# EAGLE design Driver and Matrix PCB v2 (EAGLE 9.6.2)
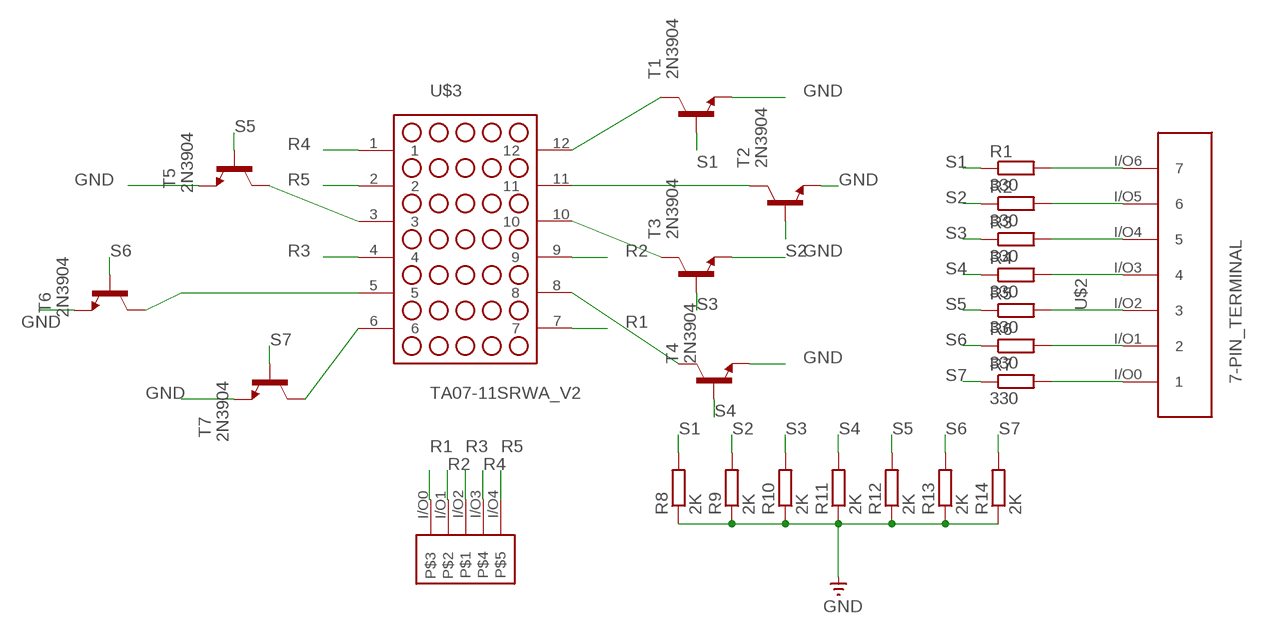
[diagram p0: schematic, sheet 1]

## Parts
GND1  GND  [GND]
R1  330  R-EU_0207/10  [0207/10]
R2  330  R-EU_0207/10  [0207/10]
R3  330  R-EU_0207/10  [0207/10]
R4  330  R-EU_0207/10  [0207/10]
R5  330  R-EU_0207/10  [0207/10]
R6  330  R-EU_0207/10  [0207/10]
R7  330  R-EU_0207/10  [0207/10]
R8  2K  R-EU_0207/12  [0207/12]
R9  2K  R-EU_0207/12  [0207/12]
R10  2K  R-EU_0207/12  [0207/12]
R11  2K  R-EU_0207/12  [0207/12]
R12  2K  R-EU_0207/12  [0207/12]
R13  2K  R-EU_0207/12  [0207/12]
R14  2K  R-EU_0207/12  [0207/12]
T1  2N3904  [TO92]
T2  2N3904  [TO92]
T3  2N3904  [TO92]
T4  2N3904  [TO92]
T5  2N3904  [TO92]
T6  2N3904  [TO92]
T7  2N3904  [TO92]
U$1  5-PIN_TERMINAL  [5-PIN_TERMINAL]
U$2  7-PIN_TERMINAL  [7-PIN_TERMINAL]
U$3  TA07-11SRWA_V2  [TA07-11SRWA_V2]

## Nets
GND: GND1.P$1(GND) R8.1 R9.1 R10.1 R11.1 R12.1 R13.1 R14.1 T1.3(E) T2.3(E) T3.3(E) T4.3(E) T5.3(E) T6.3(E) T7.3(E)
N$1: R1.2 U$2.I/O6
N$2: R2.2 U$2.I/O5
N$3: R3.2 U$2.I/O4
N$4: R4.2 U$2.I/O3
N$5: R5.2 U$2.I/O2
N$6: R6.2 U$2.I/O1
N$7: R7.2 U$2.I/O0
N$8: T7.1(C) U$3.6
N$9: T6.1(C) U$3.5
N$10: T5.1(C) U$3.3
N$11: T4.1(C) U$3.8
N$12: T3.1(C) U$3.10
N$13: T2.1(C) U$3.11
N$14: T1.1(C) U$3.12
R1: U$1.I/O0 U$3.7
R2: U$1.I/O1 U$3.9
R3: U$1.I/O2 U$3.4
R4: U$1.I/O3 U$3.1
R5: U$1.I/O4 U$3.2
S1: R1.1 R8.2 T1.2(B)
S2: R2.1 R9.2 T2.2(B)
S3: R3.1 R10.2 T3.2(B)
S4: R4.1 R11.2 T4.2(B)
S5: R5.1 R12.2 T5.2(B)
S6: R6.1 R13.2 T6.2(B)
S7: R7.1 R14.2 T7.2(B)

## Library data of the parts
GND1 = supply0:GND: SUPPLY SYMBOL
R1-R14 = rcl:R-EU_: RESISTOR, European symbol; SPICEPREFIX: R
T1-T7 = transistor:2N3904: NPN TRANSISTOR
U$1 = Custom-LED-Matrices-Test:5-PIN_TERMINAL
U$2 = Custom-LED-Matrices-Test:7-PIN_TERMINAL
U$3 = Custom-LED-Matrices-Test:TA07-11SRWA_V2: 5x7 Red LED matrix 6 pins Now with long pads

## Board
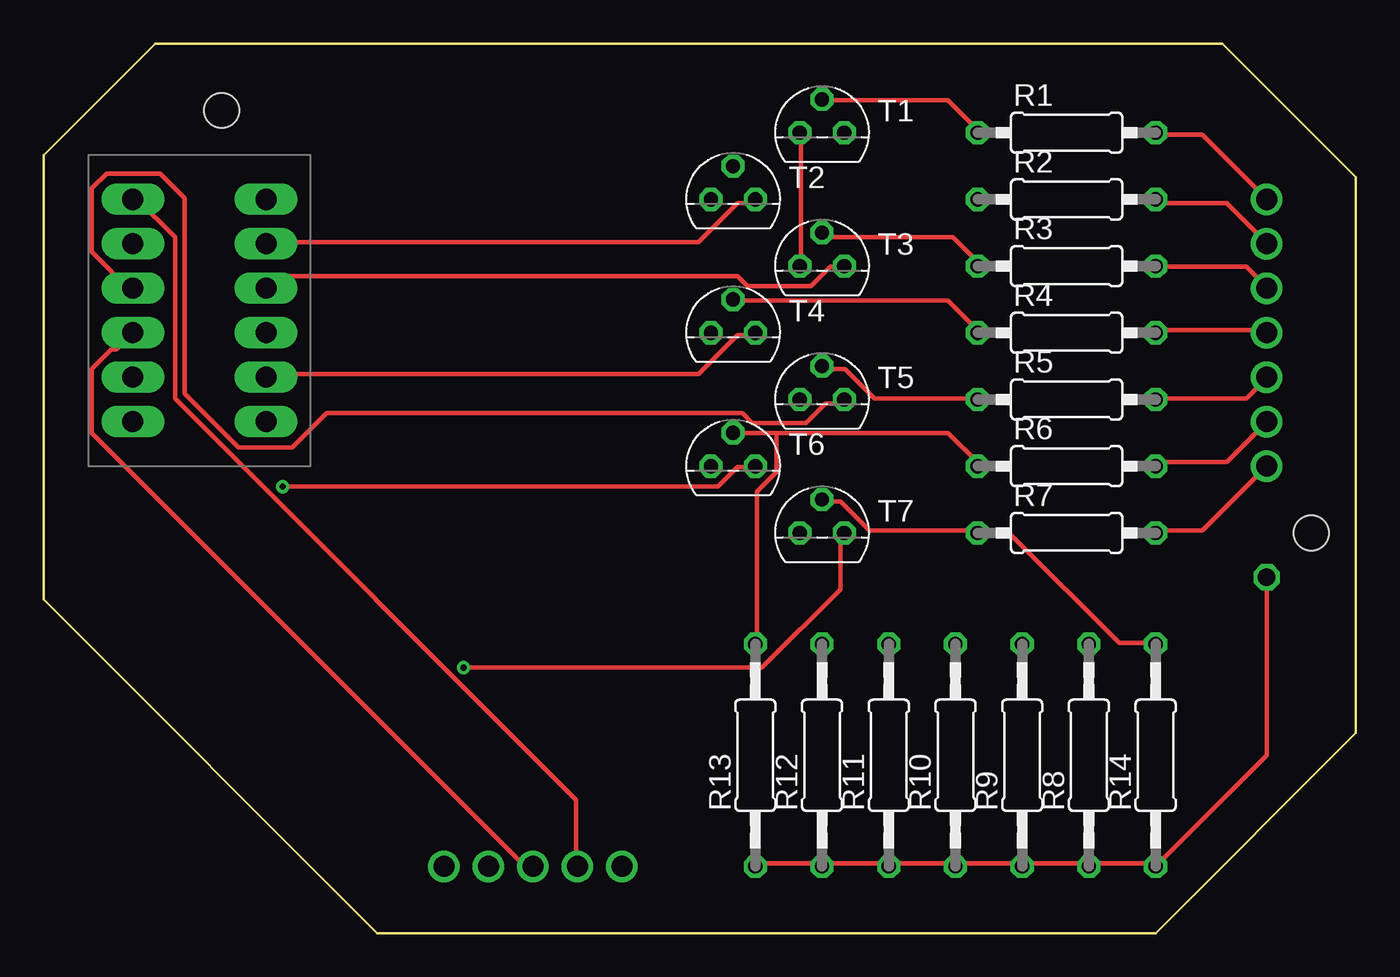
[diagram p1: board, top side]
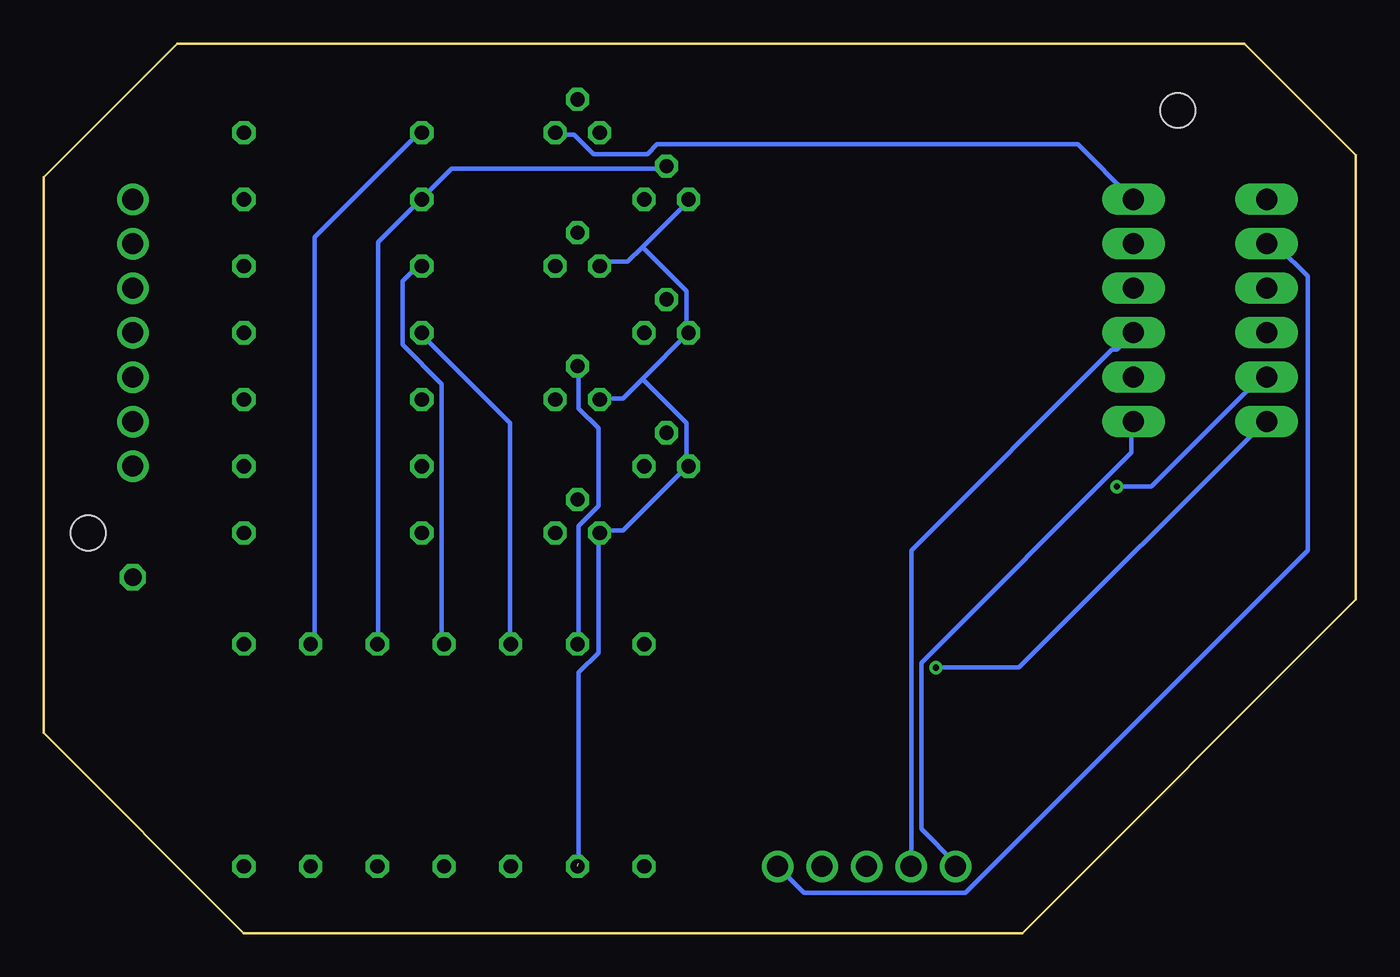
[diagram p2: board, bottom side, seen from below]

Size 74.93 x 50.8 mm. Coordinates in mm from the lower left corner, seen from the top.
Outline: 19.05,0 63.5,0 74.93,11.43 74.93,43.18 67.31,50.8 6.35,50.8 0,44.45 0,19.05 19.05,0
Copper layers (1*16): Top 0.035mm / dielectric 1.5mm / Bottom 0.035mm
Design rules "default *": minimum track width 10mil, minimum drill 0.35mm, track to track 12mil, track to pad 12mil, pad to pad 6mil, via to via 6mil, smd to smd 6mil, copper to edge 40mil, drill to drill 6mil, minimum pad ring 10mil, minimum via ring 8mil, stop-mask expansion 4mil, vias tented up to drill 0mil, thermal gap 10mil
Holes 2 mm at 10.16,46.99 72.39,22.86

### Footprints (pad centres in the part's own frame; a part is rotated, then mirrored left to right if it is on the bottom)
GND = drill 1 octagon: P$1 0,0
0207/10 = drill 0.813 octagon: 1 -5.08,0; 2 5.08,0
0207/12 = drill 0.813 octagon: 1 -6.35,0; 2 6.35,0
TO92 = drill 0.813 octagon: 1 1.27,0; 2 0,1.905; 3 -1.27,0
5-PIN_TERMINAL = drill 1.2: I/O0 0,0; I/O1 2.54,0; I/O2 5.08,0; I/O3 7.62,0; I/O4 10.16,0
7-PIN_TERMINAL = drill 1.2: I/O0 0,0; I/O1 2.54,0; I/O2 5.08,0; I/O3 7.62,0; I/O4 10.16,0; I/O5 12.7,0; I/O6 15.24,0
TA07-11SRWA_V2 = drill 1.2 long: 1 -3.81,6.35; 2 -3.81,3.81; 3 -3.81,1.27; 4 -3.81,-1.27; 5 -3.81,-3.81; 6 -3.81,-6.35; 7 3.81,-6.35; 8 3.81,-3.81; 9 3.81,-1.27; 10 3.81,1.27; 11 3.81,3.81; 12 3.81,6.35

### Placement (x,y rotation side)
GND1  69.85,20.32 0 top
R1  58.42,45.72 0 top
R2  58.42,41.91 0 top
R3  58.42,38.1 0 top
R4  58.42,34.29 0 top
R5  58.42,30.48 0 top
R6  58.42,26.67 0 top
R7  58.42,22.86 0 top
R8  59.69,10.16 90 top
R9  55.88,10.16 90 top
R10  52.07,10.16 90 top
R11  48.26,10.16 90 top
R12  44.45,10.16 90 top
R13  40.64,10.16 90 top
R14  63.5,10.16 90 top
T1  44.45,45.72 0 top
T2  39.37,41.91 0 top
T3  44.45,38.1 0 top
T4  39.37,34.29 0 top
T5  44.45,30.48 0 top
T6  39.37,26.67 0 top
T7  44.45,22.86 0 top
U$1  22.86,3.81 0 top
U$2  69.85,26.67 90 top
U$3  8.89,35.56 0 top

### Tracks (layer width: path | path; a pad name or v marks a point on that pad's centre or on a via)
GND  (1 unrouted)
  Top 0.254: T1.3 43.26,45.62 43.26,38.35 T3.3 | R13.1 40.74,3.99 44.37,3.99 R12.1 44.65,3.99 48.01,3.99 R11.1 48.28,3.99 51.92,3.99 R10.1 52.2,3.99 55.83,3.99 R9.1 56.11,3.99 59.46,3.99 R8.1 59.74,3.99 63.37,3.99 R14.1 69.85,10.16 GND1.P$1
  Bottom 0.254: 40.74,39.19 38.23,41.71 T2.3 | 40.74,39.19 41.58,38.35 42.98,38.35 T3.3 | 40.74,31.65 T4.3 38.23,34.44 38.23,36.68 40.74,39.19 | 40.74,31.65 41.86,30.53 42.98,30.53 T5.3 | 40.74,31.65 38.23,29.13 38.23,26.9 T6.3 38.23,26.62 41.86,22.99 42.98,22.99 T7.3 43.26,22.71 43.26,16 44.37,14.88 44.37,3.99
N$1
  Top 0.254: R1.2 63.65,45.62 66.17,45.62 69.8,41.99 U$2.I/O6
N$2
  Top 0.254: R2.2 63.65,41.71 67.56,41.71 69.8,39.47 U$2.I/O5
N$3
  Top 0.254: R3.2 63.65,38.07 68.68,38.07 69.8,36.96 U$2.I/O4
N$4
  Top 0.254: R4.2 63.65,34.44 69.8,34.44 U$2.I/O3
N$5
  Top 0.254: R5.2 63.65,30.53 68.68,30.53 69.8,31.65 U$2.I/O2
N$6
  Top 0.254: R6.2 63.65,26.9 67.56,26.9 69.8,29.13 U$2.I/O1
N$7
  Top 0.254: U$2.I/O0 66.17,22.99 63.65,22.99 R7.2
N$8  (via drill 0.35)
  Top 0.254: v23.98,15.16 41.02,15.16 45.49,19.63 45.49,22.71 T7.1
  Bottom 0.254: v23.98,15.16 19.23,15.16 5.26,29.13 U$3.6
N$9  (via drill 0.35)
  Top 0.254: v13.64,25.5 38.51,25.5 39.62,26.62 40.46,26.62 T6.1
  Bottom 0.254: v13.64,25.5 11.68,25.5 5.26,31.93 U$3.5
N$10
  Top 0.254: T5.1 45.49,30.25 44.65,30.25 43.54,29.13 40.46,29.13 39.9,29.69 16.15,29.69 14.2,27.74 11.12,27.74 8.05,30.81 8.05,41.99 6.65,43.38 3.58,43.38 2.74,42.55 2.74,38.91 4.98,36.68 U$3.3
N$11
  Top 0.254: T4.1 40.46,34.16 39.62,34.16 37.39,31.93 12.8,31.93 U$3.8
N$12
  Top 0.254: T3.1 45.49,38.07 44.93,38.07 43.81,36.96 40.18,36.96 39.62,37.52 13.36,37.52 12.8,36.96 U$3.10
N$13
  Top 0.254: T2.1 40.46,41.71 39.62,41.71 37.39,39.47 12.8,39.47 U$3.11
N$14
  Bottom 0.254: T1.1 45.49,45.62 44.65,45.62 43.54,44.5 40.46,44.5 39.9,45.06 15.87,45.06 12.8,41.99 U$3.12
R1
  Bottom 0.254: U$3.7 12.8,29.13 12.8,27.46 24.82,15.44 24.82,5.94 22.86,3.99 U$1.I/O0
R2
  Bottom 0.254: U$3.9 12.8,34.16 13.64,33.32 13.92,33.32 25.37,21.87 25.37,3.99 U$1.I/O1
R3
  Top 0.254: U$3.4 4.98,34.16 4.14,33.32 3.86,33.32 2.74,32.21 2.74,28.57 27.33,3.99 27.89,3.99 U$1.I/O2
R4
  Top 0.254: U$1.I/O3 30.4,3.99 30.4,7.62 7.49,30.53 7.49,39.75 5.26,41.99 U$3.1
R5
  Bottom 0.254: U$1.I/O4 31.52,2.31 22.3,2.31 2.74,21.87 2.74,37.52 4.42,39.19 4.98,39.19 U$3.2
S1
  Top 0.254: T1.2 44.65,47.57 51.64,47.57 53.31,45.9 R1.1
  Bottom 0.254: R8.2 59.46,16.56 59.46,39.75 53.59,45.62 R1.1
S2
  Bottom 0.254: T2.2 39.62,43.66 51.64,43.66 53.31,41.99 R2.1 53.59,41.71 55.83,39.47 55.83,16.56 R9.2
S3
  Top 0.254: T3.2 44.65,39.75 51.92,39.75 53.31,38.35 R3.1
  Bottom 0.254: R10.2 52.2,16.56 52.2,31.37 54.43,33.6 54.43,37.24 53.59,38.07 R3.1
S4
  Top 0.254: T4.2 39.62,36.12 51.64,36.12 53.31,34.44 R4.1
  Bottom 0.254: R11.2 48.28,16.56 48.28,29.13 53.31,34.16 R4.1
S5
  Top 0.254: R5.1 53.31,30.53 47.45,30.53 45.77,32.21 44.65,32.21 T5.2
  Bottom 0.254: R12.2 44.37,16.56 44.37,23.27 43.26,24.38 43.26,28.85 44.37,29.97 44.37,32.21 T5.2
S6
  Top 0.254: 41.86,28.57 51.64,28.57 53.31,26.9 R6.1 | 41.86,28.57 T6.2 | 41.86,28.57 41.86,26.34 40.74,25.22 40.74,16.56 R13.2
S7
  Top 0.254: T7.2 44.65,24.66 45.49,24.66 47.17,22.99 53.31,22.99 R7.1 53.59,22.71 55.27,22.71 61.42,16.56 63.37,16.56 R14.2